# Altium schematic sheet 信标底板原理图.SchDoc
size A3
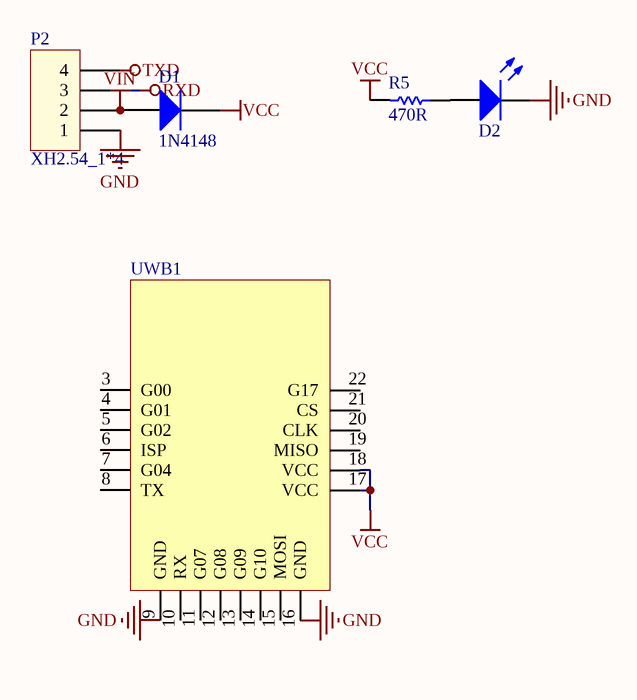
[diagram p0: 信标底板原理图.SchDoc]

## Parts
D1  1N4148  [SM0805Z_S]
D2  LED  [LED[0603]]  (value not drawn)
P2  XH2.54_1*4  [XH2.54-LI-4P]
R5  470R  [ALX_0603A]
UWB1  (no value)

## Nets
GND: D2.2(K) P2.1 UWB1.9(GND) UWB1.16(GND)
RXD: P2.3
TXD: P2.4
VCC: D1.2 R5.2 UWB1.17(VCC) UWB1.18(VCC)
VIN: D1.1 P2.2
NetD2_1: D2.1(A) R5.1

Not connected (* = marked no-connect by the designer): UWB1 3(G00) 4(G01) 5(G02) 6(ISP) 7(G04) 8(TX) 10(RX) 11(G07) 12(G08) 13(G09) 14(G10) 15(MOSI) 19(MISO) 20(CLK) 21(CS) 22(G17)

## Library data of the parts
R5 = ALX_RES
UWB1 = MK1000